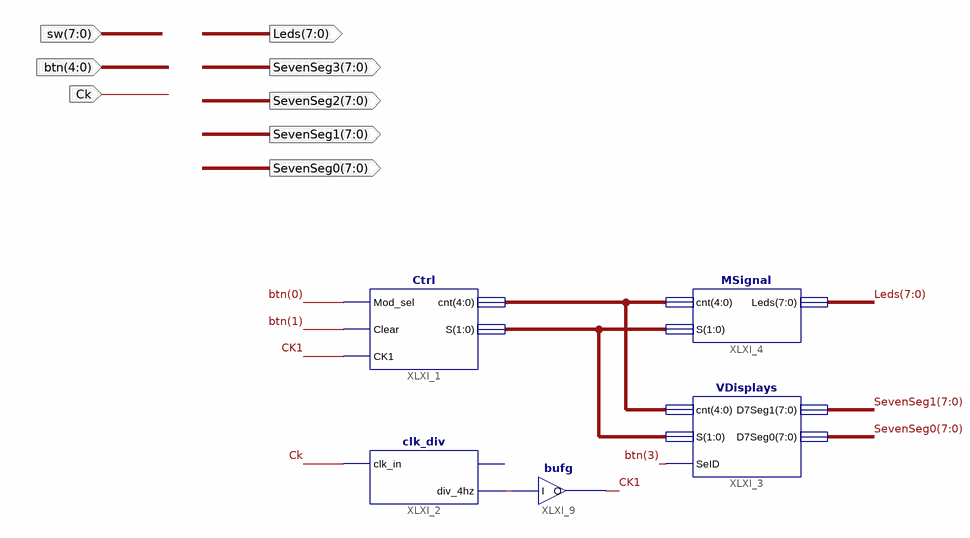
[diagram p0: schematic sheet 1]
// Xilinx ISE schematic MyDesign.sch (spartan6) as structural Verilog: 5 symbols, 8 ports
module MyDesign (
  input  [7:0] sw,
  input  [4:0] btn,
  input  Ck,
  output [7:0] Leds,
  output [7:0] SevenSeg3,
  output [7:0] SevenSeg2,
  output [7:0] SevenSeg1,
  output [7:0] SevenSeg0
);

  wire CK1, XLXN_21;
  wire [1:0] XLXN_2;
  wire [4:0] XLXN_1;

  Ctrl XLXI_1 (.CK1(CK1), .Clear(btn[1]), .cnt(XLXN_1), .Mod_sel(btn[0]), .S(XLXN_2));
  MSignal XLXI_4 (.cnt(XLXN_1), .Leds(Leds), .S(XLXN_2));
  clk_div XLXI_2 (.clk_in(Ck), .div_4hz(XLXN_21));  // open: div_1hz
  VDisplays XLXI_3 (.cnt(XLXN_1), .D7Seg0(SevenSeg0), .D7Seg1(SevenSeg1), .S(XLXN_2), .SeID(btn[3]));
  bufg XLXI_9 (.I(XLXN_21), .O(CK1));
endmodule
